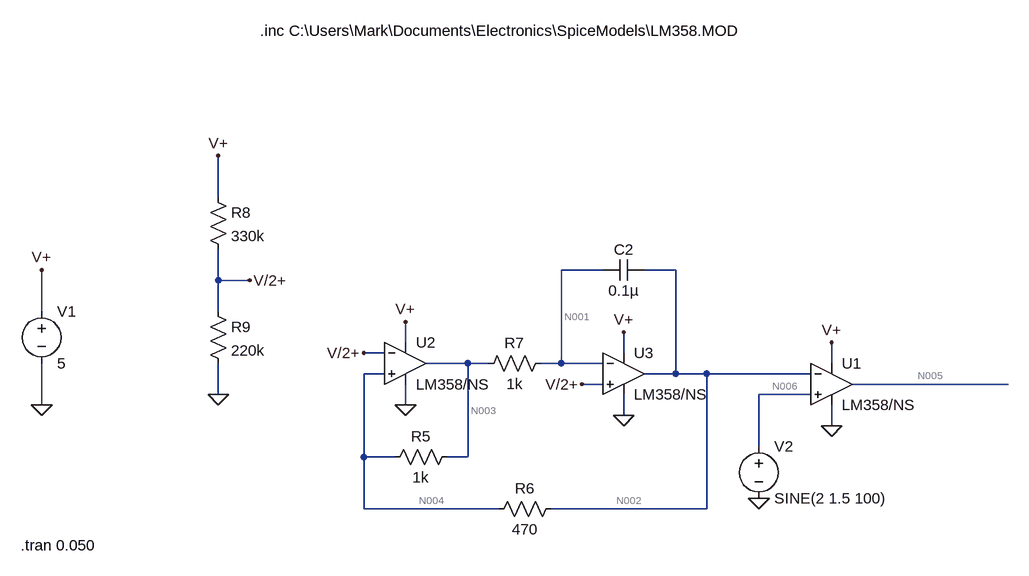
[diagram p0: schematic PWM_Generator.asc]
PWM_Generator.asc, the LTspice schematic file:
Version 4
SHEET 1 1604 680
WIRE -1776 -64 -1776 -128
WIRE -1184 48 -1248 48
WIRE -1072 48 -1120 48
WIRE -1776 64 -1776 16
WIRE -1728 64 -1776 64
WIRE -2048 112 -2048 48
WIRE -1776 112 -1776 64
WIRE -1488 160 -1488 128
WIRE -1520 176 -1552 176
WIRE -1152 176 -1152 144
WIRE -1392 192 -1456 192
WIRE -1360 192 -1392 192
WIRE -1248 192 -1248 48
WIRE -1248 192 -1280 192
WIRE -1184 192 -1248 192
WIRE -832 192 -832 160
WIRE -1520 208 -1552 208
WIRE -1072 208 -1072 48
WIRE -1072 208 -1120 208
WIRE -1024 208 -1072 208
WIRE -864 208 -1024 208
WIRE -1184 224 -1216 224
WIRE -560 224 -800 224
WIRE -1776 240 -1776 192
WIRE -864 240 -944 240
WIRE -2048 256 -2048 192
WIRE -1488 256 -1488 224
WIRE -1152 272 -1152 240
WIRE -832 288 -832 256
WIRE -944 320 -944 240
WIRE -1552 336 -1552 208
WIRE -1504 336 -1552 336
WIRE -1392 336 -1392 192
WIRE -1392 336 -1424 336
WIRE -1552 416 -1552 336
WIRE -1344 416 -1552 416
WIRE -1024 416 -1024 208
WIRE -1024 416 -1264 416
FLAG -2048 256 0
FLAG -2048 48 V+
FLAG -1152 272 0
FLAG -1488 256 0
FLAG -1152 144 V+
FLAG -1488 128 V+
FLAG -1552 176 V/2+
FLAG -1216 224 V/2+
FLAG -1776 240 0
FLAG -1776 -128 V+
FLAG -1728 64 V/2+
FLAG -944 400 0
FLAG -832 288 0
FLAG -832 160 V+
SYMBOL voltage -2048 96 R0
WINDOW 123 0 0 Left 2
WINDOW 39 0 0 Left 2
SYMATTR InstName V1
SYMATTR Value 5
SYMBOL Opamps\\opamp2 -1488 128 R0
SYMATTR InstName U2
SYMATTR Value LM358/NS
SYMBOL Opamps\\opamp2 -1152 144 R0
SYMATTR InstName U3
SYMATTR Value LM358/NS
SYMBOL cap -1120 32 R90
WINDOW 0 0 32 VBottom 2
WINDOW 3 32 32 VTop 2
SYMATTR InstName C2
SYMATTR Value 0.1µ
SYMBOL res -1408 320 R90
WINDOW 0 0 56 VBottom 2
WINDOW 3 32 56 VTop 2
SYMATTR InstName R5
SYMATTR Value 1k
SYMBOL res -1248 400 R90
WINDOW 0 0 56 VBottom 2
WINDOW 3 32 56 VTop 2
SYMATTR InstName R6
SYMATTR Value 470
SYMBOL res -1264 176 R90
WINDOW 0 0 56 VBottom 2
WINDOW 3 32 56 VTop 2
SYMATTR InstName R7
SYMATTR Value 1k
SYMBOL res -1792 -80 R0
SYMATTR InstName R8
SYMATTR Value 330k
SYMBOL res -1792 96 R0
SYMATTR InstName R9
SYMATTR Value 220k
SYMBOL voltage -944 304 R0
WINDOW 123 0 0 Left 2
WINDOW 39 0 0 Left 2
SYMATTR InstName V2
SYMATTR Value SINE(2 1.5 100)
SYMBOL Opamps\\opamp2 -832 160 R0
SYMATTR InstName U1
SYMATTR Value LM358/NS
TEXT -2080 472 Left 2 !.tran 0.050
TEXT -1712 -320 Left 2 !.inc C:\\Users\\Mark\\Documents\\Electronics\\SpiceModels\\LM358.MOD

The netlist it stands for:
* PWM_Generator.asc
V1 V+ 0 5
XU2 N004 V/2+ V+ 0 N003 LM358/NS  ; pins In+ In- V+ V- OUT
XU3 V/2+ N001 V+ 0 N002 LM358/NS  ; pins In+ In- V+ V- OUT
C2 N002 N001 0.1µ
R5 N003 N004 1k
R6 N002 N004 470
R7 N001 N003 1k
R8 V+ V/2+ 330k
R9 V/2+ 0 220k
V2 N006 0 SINE(2 1.5 100)
XU1 N006 N002 V+ 0 N005 LM358/NS  ; pins In+ In- V+ V- OUT
.tran 0.050
.inc C:\Users\Mark\Documents\Electronics\SpiceModels\LM358.MOD
.backanno
.end

* Results of the author's LTspice run, read from the files saved beside the schematic
* Operating Point, zero values left out:
*   V(v+) = 5 V
*   V(v/2+) = 2.012 V
*   V(n004) = 2.01 V
*   V(n003) = 2.014 V
*   V(n001) = 2.014 V
*   V(n002) = 2.008 V
*   V(n006) = 2 V
*   V(n005) = 52.67 mV
*   I(R9) = 9.145 µA
*   I(R8) = 9.055 µA
*   I(R7) = 37.98 nA
*   I(R6) = -3.969 µA
*   I(R5) = 3.917 µA
*   I(V2) = 63.23 nA
*   I(V1) = 136.1 µA
*   Ix(u2:1) = -51.94 nA
*   Ix(u2:2) = -37.98 nA
*   Ix(u2:99) = -44.41 µA
*   Ix(u2:50) = 48.38 µA
*   Ix(u2:28) = -3.879 µA
*   Ix(u3:1) = -51.94 nA
*   Ix(u3:2) = -37.98 nA
*   Ix(u3:99) = -48.35 µA
*   Ix(u3:50) = 44.44 µA
*   Ix(u3:28) = 3.996 µA
*   Ix(u1:1) = -63.23 nA
*   Ix(u1:2) = -26.7 nA
*   Ix(u1:99) = -52.4 µA
*   Ix(u1:50) = 52.49 µA
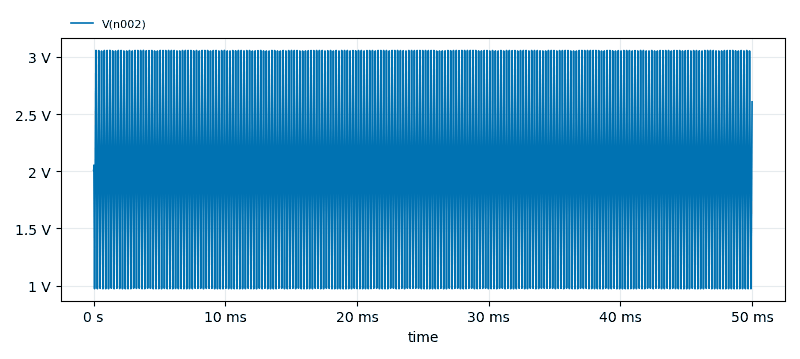
[diagram p1: Transient Analysis of PWM_Generator.asc, plotted from the saved traces]
* Transient Analysis, 1 run:
*   V(n002): min 971 mV, max 3.058 V, average 2.013 V, rms 2.114 V, last 2.626 V